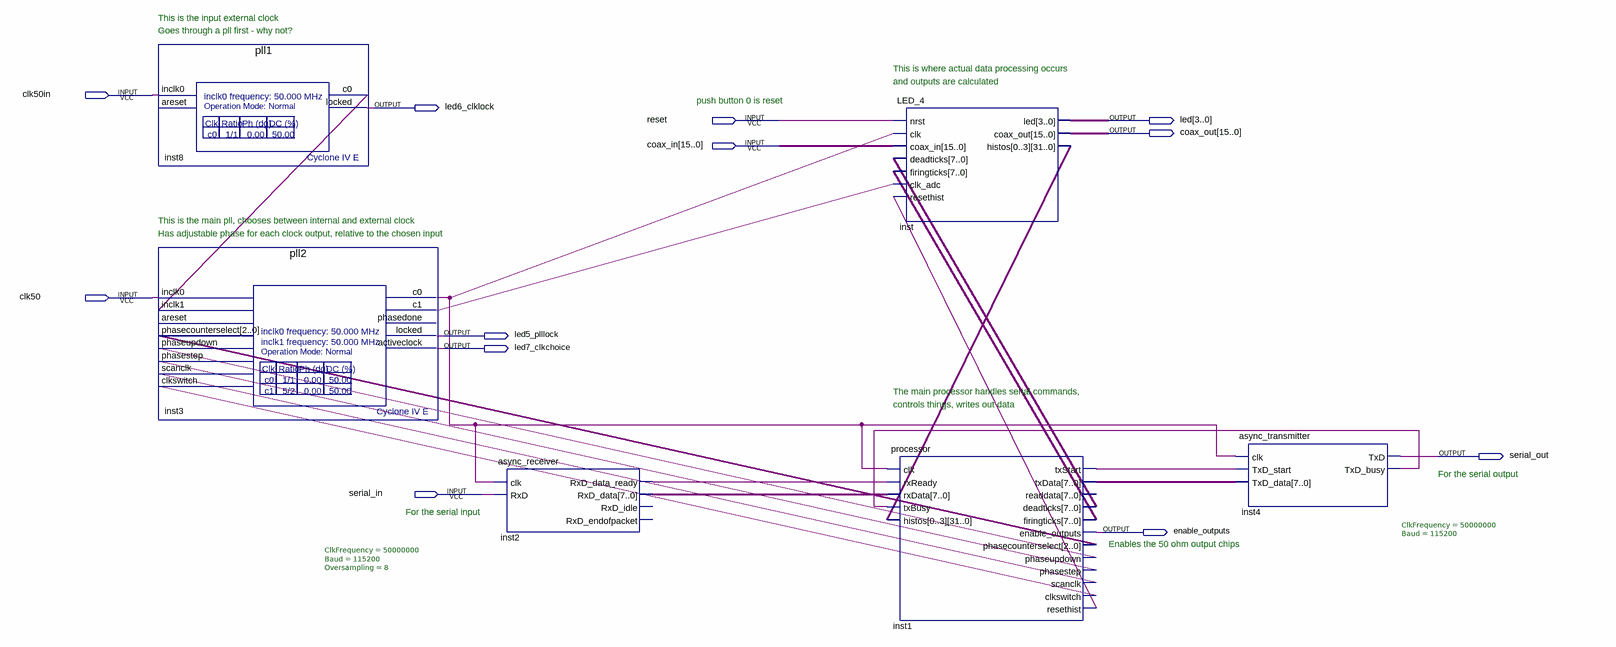
[diagram p0: schematic sheet]
// Quartus schematic coincidence.bdf as structural Verilog: 6 symbols, 12 pins
module coincidence (
  input  clk50in,
  input  reset,
  input  [15:0] coax_in,
  input  clk50,
  input  serial_in,
  output led6_clklock,
  output [3:0] led,
  output [15:0] coax_out,
  output led5_plllock,
  output led7_clkchoice,
  output serial_out,
  output enable_outputs
);

  wire inst1_clkswitch, inst1_phasestep, inst1_phaseupdown, inst1_resethist, inst1_scanclk, inst1_txstart,
       inst2_rxd_data_ready, inst3_c0, inst3_c1, inst4_txd_busy, inst8_c0;
  wire [2:0] inst1_phasecounterselect;
  wire [7:0] inst1_deadticks, inst1_firingticks, inst1_txdata, inst2_rxd_data;
  wire [127:0] inst_histos;

  pll1 inst8 (.inclk0(clk50in), .c0(inst8_c0), .locked(led6_clklock));  // open: areset
  pll2 inst3 (
    .inclk0(clk50), .inclk1(inst8_c0), .phasecounterselect(inst1_phasecounterselect),
    .phaseupdown(inst1_phaseupdown), .phasestep(inst1_phasestep), .scanclk(inst1_scanclk),
    .clkswitch(inst1_clkswitch), .c0(inst3_c0), .c1(inst3_c1), .locked(led5_plllock),
    .activeclock(led7_clkchoice));  // open: areset, phasedone
  async_receiver #(.ClkFrequency(50000000), .Baud(115200), .Oversampling(8)) inst2 (
    .clk(inst3_c0), .RxD(serial_in), .RxD_data_ready(inst2_rxd_data_ready), .RxD_data(inst2_rxd_data));  // open: RxD_idle, RxD_endofpacket
  LED_4 inst (
    .nrst(reset), .clk(inst3_c0), .coax_in(coax_in), .deadticks(inst1_deadticks),
    .firingticks(inst1_firingticks), .clk_adc(inst3_c1), .resethist(inst1_resethist), .led(led),
    .coax_out(coax_out), .histos(inst_histos));
  processor inst1 (
    .clk(inst3_c0), .rxReady(inst2_rxd_data_ready), .rxData(inst2_rxd_data), .txBusy(inst4_txd_busy),
    .histos(inst_histos), .txStart(inst1_txstart), .txData(inst1_txdata), .deadticks(inst1_deadticks),
    .firingticks(inst1_firingticks), .enable_outputs(enable_outputs),
    .phasecounterselect(inst1_phasecounterselect), .phaseupdown(inst1_phaseupdown),
    .phasestep(inst1_phasestep), .scanclk(inst1_scanclk), .clkswitch(inst1_clkswitch),
    .resethist(inst1_resethist));  // open: readdata
  async_transmitter #(.ClkFrequency(50000000), .Baud(115200)) inst4 (
    .clk(inst3_c0), .TxD_start(inst1_txstart), .TxD_data(inst1_txdata), .TxD(serial_out),
    .TxD_busy(inst4_txd_busy));

  // Notes on the sheet:
  //   This is the input external clock
  //   Goes through a pll first - why not?
  //   This is where actual data processing occurs
  //   and outputs are calculated
  //   push button 0 is reset
  //   This is the main pll, chooses between internal and external clock
  //   Has adjustable phase for each clock output, relative to the chosen input
  //   The main processor handles serial commands, 
  //   controls things, writes out data
  //   For the serial output
  //   For the serial input
  //   Enables the 50 ohm output chips
endmodule
